# EAGLE design analog-sampler-testbed (EAGLE 9.5.0)
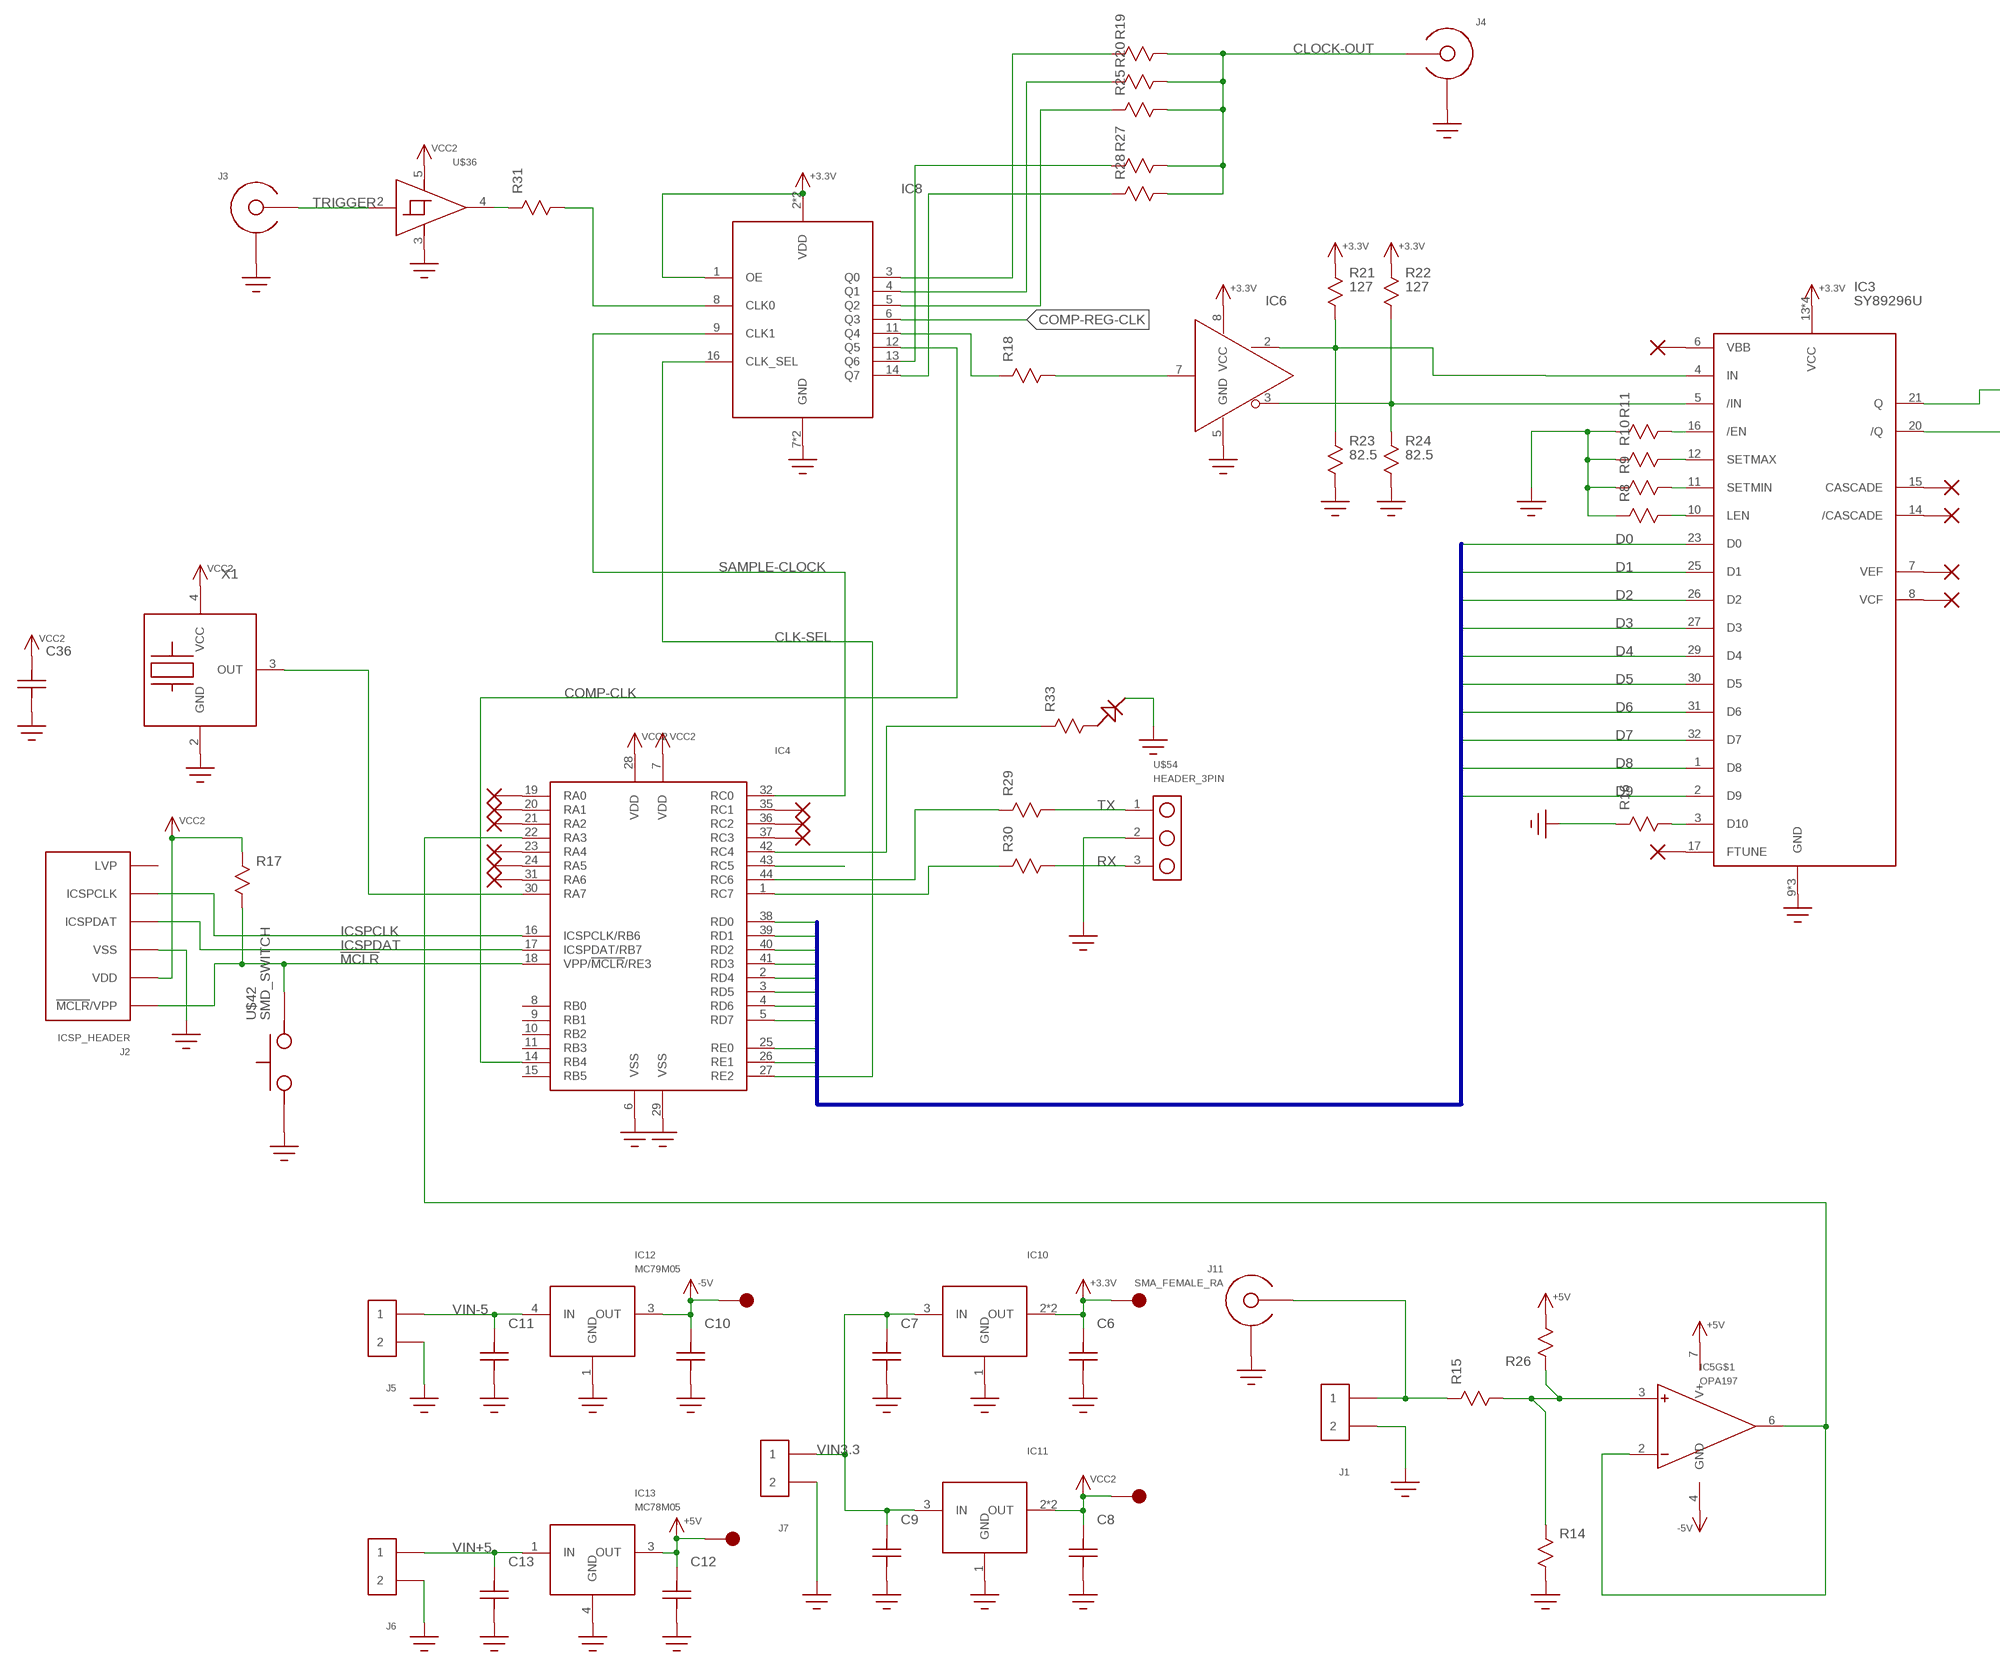
[diagram p0: schematic, sheet 1, part 1 of 2]
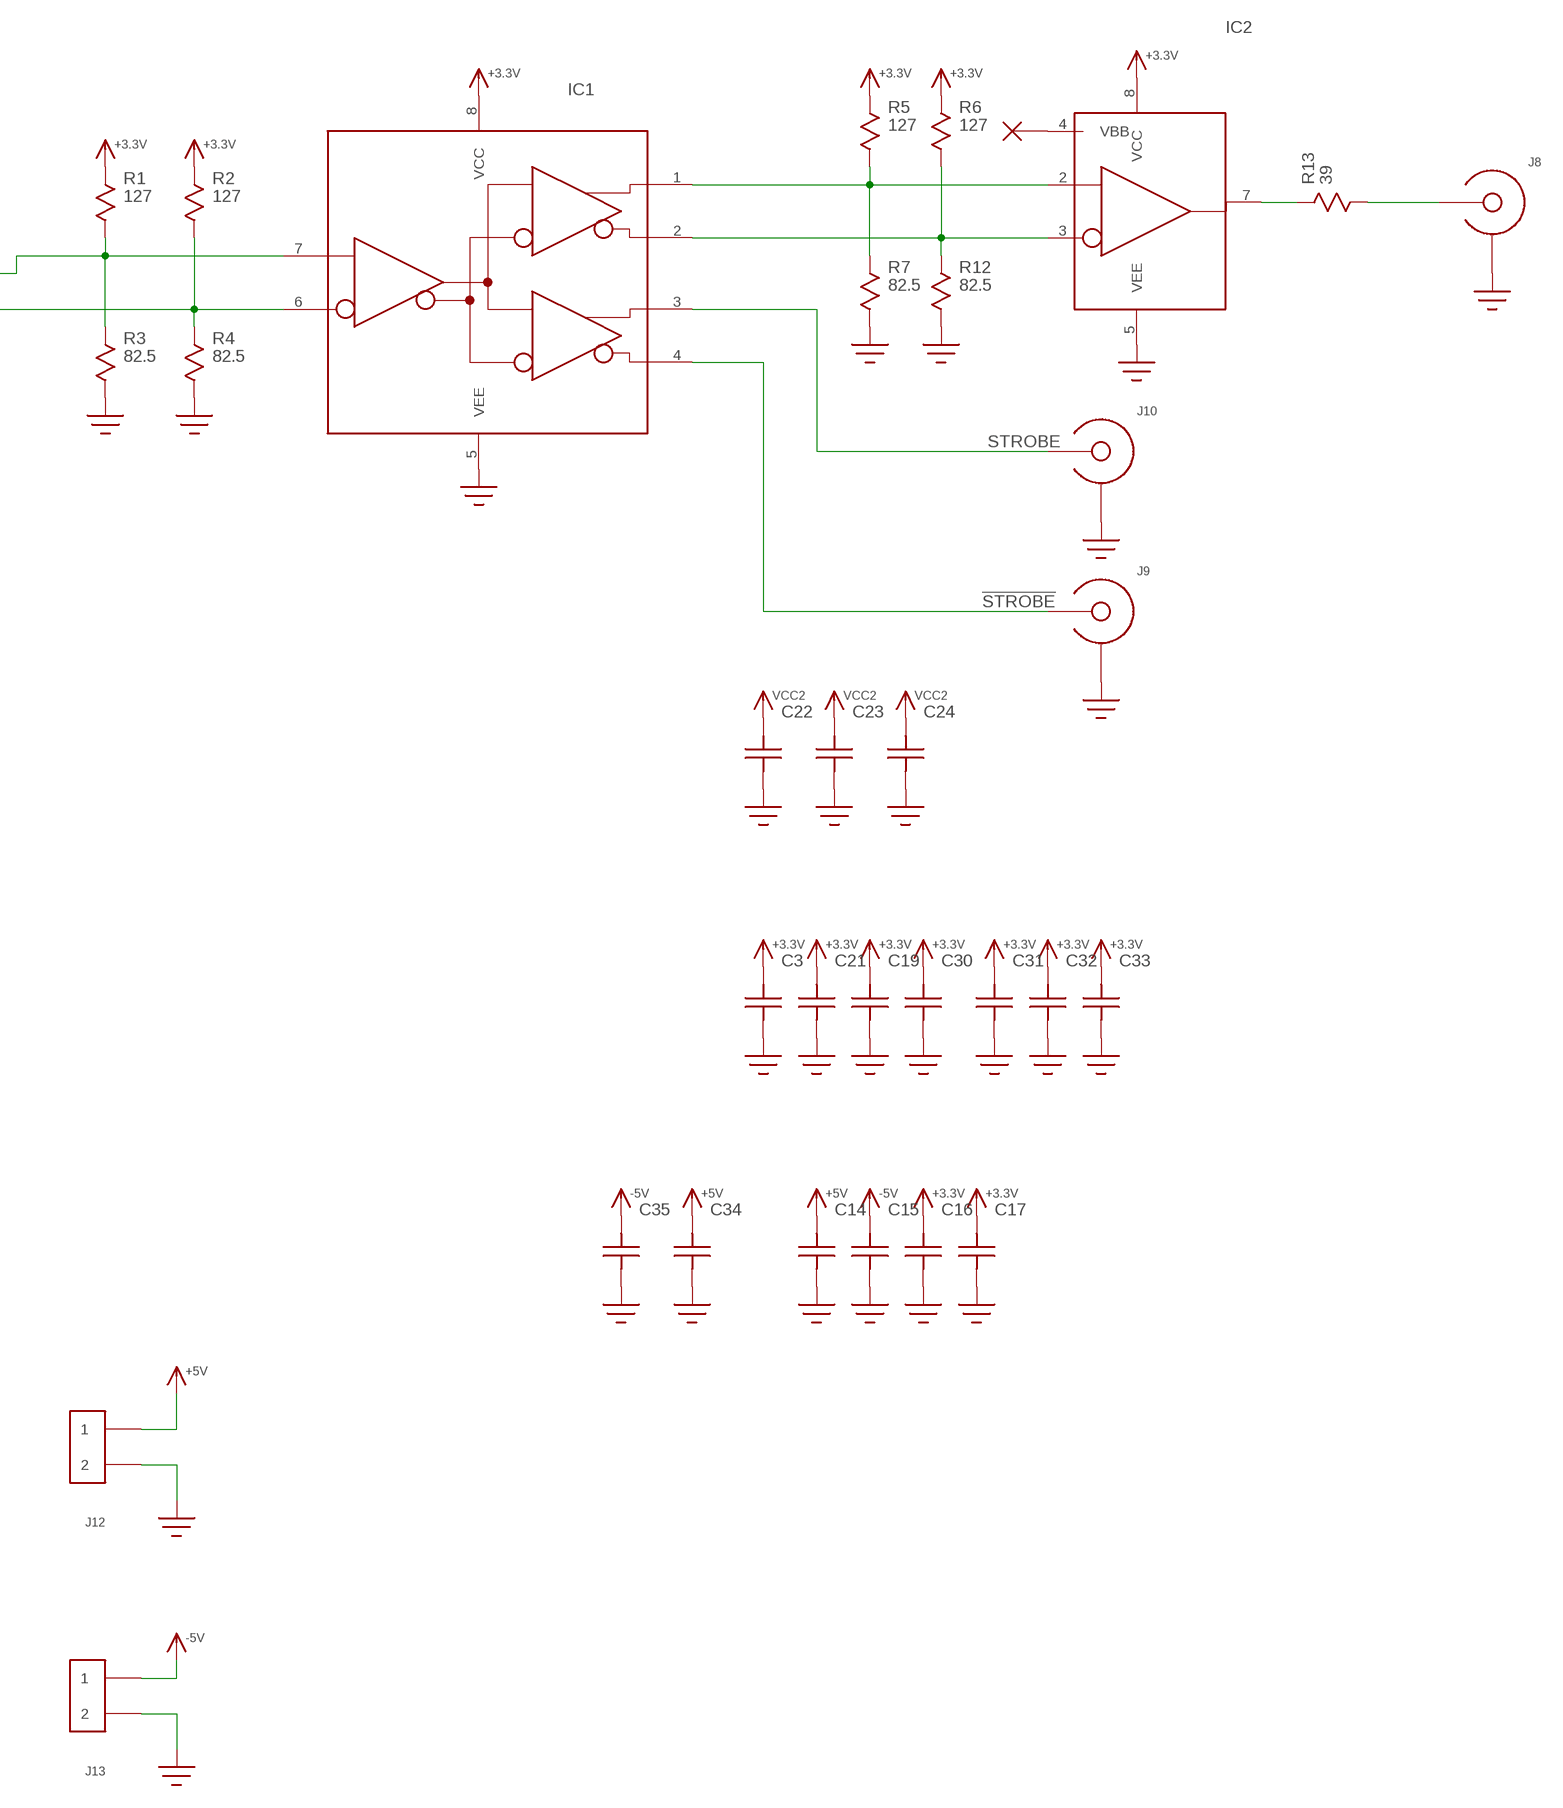
[diagram p1: schematic, sheet 1, part 2 of 2]

## Parts
C3  C0603  [C0603]
C6  C1206  [1206]
C7  C1206  [1206]
C8  C1206  [1206]
C9  C1206  [1206]
C10  C1206  [1206]
C11  C1206  [1206]
C12  C1206  [1206]
C13  C1206  [1206]
C14  C0603  [C0603]
C15  C0603  [C0603]
C16  C0603  [C0603]
C17  C0603  [C0603]
C19  C0603  [C0603]
C21  C0603  [C0603]
C22  C0603  [C0603]
C23  C0603  [C0603]
C24  C0603  [C0603]
C30  C0603  [C0603]
C31  C0603  [C0603]
C32  C0603  [C0603]
C33  C0603  [C0603]
C34  C0603  [C0603]
C35  C0603  [C0603]
C36  C0603  [C0603]
IC1  SY10EP11U  [SOIC8]
IC2  MC100EPT21  [SOIC8]
IC3  SY89296U  [TQFP32_7X7]
IC4  PIC16F15376  [TQFP44]
IC5  OPA197  OPA197SOIC8  [SOIC8]
IC6  MC100LVELT20  [SOIC8]
IC8  SI53360TSSOP16  [TSSOP16]
IC10  AZ1117E  [SOT-223]
IC11  AZ1117E  [SOT-223]
IC12  MC79M05  MC79M00  [DPAK]
IC13  MC78M05  MC78M00  [DPAK]
J1  HEADER_2PIN  [HEADER_2PIN]
J2  ICSP_HEADER  [HEADER_6PIN]
J3  SMA-EDGE-LAUNCH4L-4020-TAPER-FIXED  [SMA_EDGE_LAUNCH_4L_4020_TAPER_FIXED]
J4  SMA-EDGE-LAUNCH4L-4020-TAPER-FIXED  [SMA_EDGE_LAUNCH_4L_4020_TAPER_FIXED]
J5  HEADER_2PINSCREW-TERM  [FCI_20020316_SCREW_TERM_2P]
J6  HEADER_2PINSCREW-TERM  [FCI_20020316_SCREW_TERM_2P]
J7  HEADER_2PINSCREW-TERM  [FCI_20020316_SCREW_TERM_2P]
J8  SMA-EDGE-LAUNCH4L-4020-TAPER-FIXED  [SMA_EDGE_LAUNCH_4L_4020_TAPER_FIXED]
J9  SMA-EDGE-LAUNCH4L-4020-TAPER-FIXED  [SMA_EDGE_LAUNCH_4L_4020_TAPER_FIXED]
J10  SMA-EDGE-LAUNCH4L-4020-TAPER-FIXED  [SMA_EDGE_LAUNCH_4L_4020_TAPER_FIXED]
J11  SMA_FEMALE_RA  [SMA_RA_PCB]
J12  HEADER_2PIN  [HEADER_2PIN]
J13  HEADER_2PIN  [HEADER_2PIN]
P3  ICSP_PAD  [ICSP_PAD]
P4  ICSP_PAD  [ICSP_PAD]
P5  ICSP_PAD  [ICSP_PAD]
P6  ICSP_PAD  [ICSP_PAD]
R1  127  R0603  [R0603]
R2  127  R0603  [R0603]
R3  82.5  R0603  [R0603]
R4  82.5  R0603  [R0603]
R5  127  R0603  [R0603]
R6  127  R0603  [R0603]
R7  82.5  R0603  [R0603]
R8  R0402  [0402]
R9  R0402  [0402]
R10  R0402  [0402]
R11  R0402  [0402]
R12  82.5  R0603  [R0603]
R13  39  R0603  [R0603]
R14  R0603  [R0603]
R15  R0603  [R0603]
R16  R0603  [R0603]
R17  R0603  [R0603]
R18  R0603  [R0603]
R19  R0402  [0402]
R20  R0402  [0402]
R21  127  R0603  [R0603]
R22  127  R0603  [R0603]
R23  82.5  R0603  [R0603]
R24  82.5  R0603  [R0603]
R25  R0402  [0402]
R26  R0603  [R0603]
R27  R0402  [0402]
R28  R0402  [0402]
R29  R0603  [R0603]
R30  R0603  [R0603]
R31  R0603  [R0603]
R33  R0603  [R0603]
U$11  NO_CONNECT  (no package)
U$24  NO_CONNECT  (no package)
U$25  NO_CONNECT  (no package)
U$26  NO_CONNECT  (no package)
U$27  NO_CONNECT  (no package)
U$28  NO_CONNECT  (no package)
U$36  74LVC1G17  [SOT23-5]
U$42  SMD_SWITCH  [SMD_SWITCH]
U$54  HEADER_3PIN  [HEADER_3PIN]
U$57  NO_CONNECT  (no package)
U$86  NO_CONNECT  (no package)
U$87  NO_CONNECT  (no package)
U$88  LED_0603  [LED_0603]
U$90  NO_CONNECT  (no package)
U$91  NO_CONNECT  (no package)
U$92  NO_CONNECT  (no package)
U$93  NO_CONNECT  (no package)
U$95  NO_CONNECT  (no package)
U$96  NO_CONNECT  (no package)
U$98  NO_CONNECT  (no package)
X1  XTAL_OSC  [XTAL_3.2X5]

## Nets
!MCLR!: IC4.18(VPP/!MCLR!/RE3) J2.1(!MCLR!/VPP) R17.P$2 U$42.P$3 U$42.P$4
!STROBE!: IC1.4(!Q1!) J9.CENTER@1(CENTER) J9.P$3(CENTER)
+3.3V: C3.P$2 C6.P$2 C16.P$2 C17.P$2 C19.P$2 C21.P$2 C30.P$2 C31.P$2 C32.P$2 C33.P$2 IC1.8(VCC) IC2.8(VCC) IC3.13(VCC) IC3.18(VCC) IC3.19(VCC) IC3.22(VCC) IC6.8(VCC) IC8.1(OE) IC8.2(VDD) IC8.15(VDD) IC10.2(OUT) IC10.4(OUT) P5.P$1 R1.P$1 R2.P$1 R5.P$1 R6.P$1 R21.P$1 R22.P$1
+5V: C12.P$2 C14.P$2 C34.P$2 IC5.7(V+) IC13.3(OUT) J12.1 P4.P$1 R26.P$2
-5V: C10.P$2 C15.P$2 C35.P$2 IC5.4(GND) IC12.3(OUT) J13.1 P3.P$1
CLK-SEL: IC4.27(RE2) IC8.16(CLK_SEL)
CLOCK-OUT: J4.CENTER@1(CENTER) J4.P$3(CENTER) R19.2 R20.2 R25.2 R27.2 R28.2
COMP-CLK: IC4.14(RB4) IC8.12(Q5)
COMP-REG-CLK: IC8.6(Q3)
D0: IC3.23(D0) IC4.38(RD0)
D1: IC3.25(D1) IC4.39(RD1)
D2: IC3.26(D2) IC4.40(RD2)
D3: IC3.27(D3) IC4.41(RD3)
D4: IC3.29(D4) IC4.2(RD4)
D5: IC3.30(D5) IC4.3(RD5)
D6: IC3.31(D6) IC4.4(RD6)
D7: IC3.32(D7) IC4.5(RD7)
D8: IC3.1(D8) IC4.25(RE0)
D9: IC3.2(D9) IC4.26(RE1)
GND: C3.P$1 C6.P$1 C7.P$1 C8.P$1 C9.P$1 C10.P$1 C11.P$1 C12.P$1 C13.P$1 C14.P$1 C15.P$1 C16.P$1 C17.P$1 C19.P$1 C21.P$1 C22.P$1 C23.P$1 C24.P$1 C30.P$1 C31.P$1 C32.P$1 C33.P$1 C34.P$1 C35.P$1 C36.P$1 IC1.5(VEE) IC2.5(VEE) IC3.9(GND) IC3.24(GND) IC3.28(GND) IC4.6(VSS) IC4.29(VSS) IC6.5(GND) IC8.7(GND) IC8.10(GND) IC10.1(GND) IC11.1(GND) IC12.1(GND) IC13.4(GND) J1.2 J2.3(VSS) J3.BOTTOM_GND(SHIELD) J3.GND@1(SHIELD) J3.GND@2(SHIELD) J3.GND@3(SHIELD) J3.GND@4(SHIELD) J3.GND@5(SHIELD) J3.GND@6(SHIELD) J3.GND@7(SHIELD) J3.GND@8(SHIELD) J3.GND@14(SHIELD) J3.GND@15(SHIELD) J3.GND@16(SHIELD) J3.GND@17(SHIELD) J3.GND_PAD1(SHIELD) J3.GND_PAD2(SHIELD) J3.P$1(SHIELD) J3.P$2(SHIELD) J4.BOTTOM_GND(SHIELD) J4.GND@1(SHIELD) J4.GND@2(SHIELD) J4.GND@3(SHIELD) J4.GND@4(SHIELD) J4.GND@5(SHIELD) J4.GND@6(SHIELD) J4.GND@7(SHIELD) J4.GND@8(SHIELD) J4.GND@14(SHIELD) J4.GND@15(SHIELD) J4.GND@16(SHIELD) J4.GND@17(SHIELD) J4.GND_PAD1(SHIELD) J4.GND_PAD2(SHIELD) J4.P$1(SHIELD) J4.P$2(SHIELD) J5.P$2 J6.P$2 J7.P$2 J8.BOTTOM_GND(SHIELD) J8.GND@1(SHIELD) J8.GND@2(SHIELD) J8.GND@3(SHIELD) J8.GND@4(SHIELD) J8.GND@5(SHIELD) J8.GND@6(SHIELD) J8.GND@7(SHIELD) J8.GND@8(SHIELD) J8.GND@14(SHIELD) J8.GND@15(SHIELD) J8.GND@16(SHIELD) J8.GND@17(SHIELD) J8.GND_PAD1(SHIELD) J8.GND_PAD2(SHIELD) J8.P$1(SHIELD) J8.P$2(SHIELD) J9.BOTTOM_GND(SHIELD) J9.GND@1(SHIELD) J9.GND@2(SHIELD) J9.GND@3(SHIELD) J9.GND@4(SHIELD) J9.GND@5(SHIELD) J9.GND@6(SHIELD) J9.GND@7(SHIELD) J9.GND@8(SHIELD) J9.GND@14(SHIELD) J9.GND@15(SHIELD) J9.GND@16(SHIELD) J9.GND@17(SHIELD) J9.GND_PAD1(SHIELD) J9.GND_PAD2(SHIELD) J9.P$1(SHIELD) J9.P$2(SHIELD) J10.BOTTOM_GND(SHIELD) J10.GND@1(SHIELD) J10.GND@2(SHIELD) J10.GND@3(SHIELD) J10.GND@4(SHIELD) J10.GND@5(SHIELD) J10.GND@6(SHIELD) J10.GND@7(SHIELD) J10.GND@8(SHIELD) J10.GND@14(SHIELD) J10.GND@15(SHIELD) J10.GND@16(SHIELD) J10.GND@17(SHIELD) J10.GND_PAD1(SHIELD) J10.GND_PAD2(SHIELD) J10.P$1(SHIELD) J10.P$2(SHIELD) J11.SHIELD@1(SHIELD) J11.SHIELD@2(SHIELD) J11.SHIELD@3(SHIELD) J11.SHIELD@4(SHIELD) J12.2 J13.2 R3.P$2 R4.P$2 R7.P$2 R8.1 R9.1 R10.1 R11.1 R12.P$2 R14.P$2 R16.P$1 R23.P$2 R24.P$2 U$36.3(GND) U$42.P$1 U$42.P$2 U$54.2 U$88.C X1.2(GND)
ICSPCLK: IC4.16(ICSPCLK/RB6) J2.5(ICSPCLK)
ICSPDAT: IC4.17(ICSPDAT/RB7) J2.4(ICSPDAT)
LE_N: IC1.7(D) IC3.21(Q) R1.P$2 R3.P$1
LE_P1: IC1.6(!D!) IC3.20(/Q) R2.P$2 R4.P$1
N$1: R31.P$1 U$36.4(OUT)
N$2: IC1.1(Q0) IC2.2(D) R5.P$2 R7.P$1
N$3: IC1.2(!Q0!) IC2.3(!D!) R6.P$2 R12.P$1
N$4: IC2.4(VBB) U$11.P$1
N$5: IC2.7(Q) R13.P$1
N$6: IC3.16(/EN) R11.2
N$7: IC3.12(SETMAX) R10.2
N$8: IC3.11(SETMIN) R9.2
N$9: IC3.10(LEN) R8.2
N$10: IC3.15(CASCADE) U$24.P$1
N$11: IC3.14(/CASCADE) U$25.P$1
N$12: IC3.7(VEF) U$26.P$1
N$13: IC3.8(VCF) U$27.P$1
N$14: IC3.6(VBB) U$28.P$1
N$15: J8.CENTER@1(CENTER) J8.P$3(CENTER) R13.P$2
N$16: IC3.4(IN) IC6.2(Q) R21.P$2 R23.P$1
N$17: IC4.22(RA3) IC5.2(-) IC5.6(OUT)
N$18: IC8.11(Q4) R18.P$1
N$19: IC5.3(+) R14.P$1 R15.P$2 R26.P$1
N$20: IC4.43(RC5)
N$21: J1.1 J11.CENTER R15.P$1
N$22: IC3.5(/IN) IC6.3(!Q!) R22.P$2 R24.P$1
N$23: IC8.8(CLK0) R31.P$2
N$24: IC4.30(RA7) X1.3(OUT)
N$25: IC4.42(RC4) R33.P$1
N$26: R33.P$2 U$88.A
N$35: IC3.3(D10) R16.P$2
N$36: IC6.7(D) R18.P$2
N$38: IC8.14(Q7) R28.1
N$39: IC8.13(Q6) R27.1
N$41: IC8.5(Q2) R25.1
N$42: IC8.4(Q1) R20.1
N$43: IC8.3(Q0) R19.1
N$44: IC4.44(RC6) R29.P$1
N$45: IC4.1(RC7) R30.P$1
N$47: IC4.35(RC1) U$57.P$1
N$48: IC4.36(RC2) U$86.P$1
N$49: IC4.37(RC3) U$87.P$1
N$52: IC3.17(FTUNE) U$90.P$1
N$53: IC4.19(RA0) U$91.P$1
N$54: IC4.20(RA1) U$92.P$1
N$55: IC4.21(RA2) U$93.P$1
N$57: IC4.23(RA4) U$95.P$1
N$58: IC4.24(RA5) U$96.P$1
N$60: IC4.31(RA6) U$98.P$1
RX: R30.P$2 U$54.3
SAMPLE-CLOCK: IC4.32(RC0) IC8.9(CLK1)
STROBE: IC1.3(Q1) J10.CENTER@1(CENTER) J10.P$3(CENTER)
TRIGGER: J3.CENTER@1(CENTER) J3.P$3(CENTER) U$36.2(IN)
TX: R29.P$2 U$54.1
VCC2: C8.P$2 C22.P$2 C23.P$2 C24.P$2 C36.P$2 IC4.7(VDD) IC4.28(VDD) IC11.2(OUT) IC11.4(OUT) J2.2(VDD) P6.P$1 R17.P$1 U$36.5(VCC) X1.4(VCC)
VIN3.3: C7.P$2 C9.P$2 IC10.3(IN) IC11.3(IN) J7.P$1
VIN+5: C13.P$2 IC13.1(IN) J6.P$1
VIN-5: C11.P$2 IC12.4(IN) J5.P$1
Unconnected: IC4.8(RB0) IC4.9(RB1) IC4.10(RB2) IC4.11(RB3) IC4.15(RB5) J2.6(LVP)

## Buses
D0,D1,D2,D3,D4,D5,D6,D7,D8,D9

## Library data of the parts
C3 C6-C17 C19 C21-C24 C30-C36 = yapo:C
IC1 = yapo:SY10EP11U
IC2 = yapo:MC100EPT21
IC3 = yapo:SY89296U
IC4 = yapo:PIC16F15376
IC5 = yapo:OPA197
IC6 = yapo:MC100LVELT20
IC8 = yapo:SI53360
IC10 IC11 = yapo:AZ1117E
IC12 = yapo:MC79M00
IC13 = yapo:MC78M00
J1 J5-J7 J12 J13 = yapo:HEADER_2PIN
J2 = yapo:ICSP_HEADER
J3 J4 J8-J10 = sma_footprint_2l:SMA-EDGE-LAUNCH
J11 = yapo:SMA_FEMALE_RA
P3-P6 = yapo:ICSP_PAD
R1-R31 R33 = yapo:R
U$11 U$24-U$28 U$57 U$86 U$87 U$90-U$93 U$95 U$96 U$98 = yapo:NO_CONNECT
U$36 = yapo:74LVC1G17
U$42 = yapo:SMD_SWITCH
U$54 = yapo:HEADER_3PIN
U$88 = yapo:LED_0603
X1 = yapo:XTAL_OSC

## Net classes
1 diff-pair: width 0.33 mm, clearance 0.203 mm
2 50-ohm: width 0.349 mm

## Board
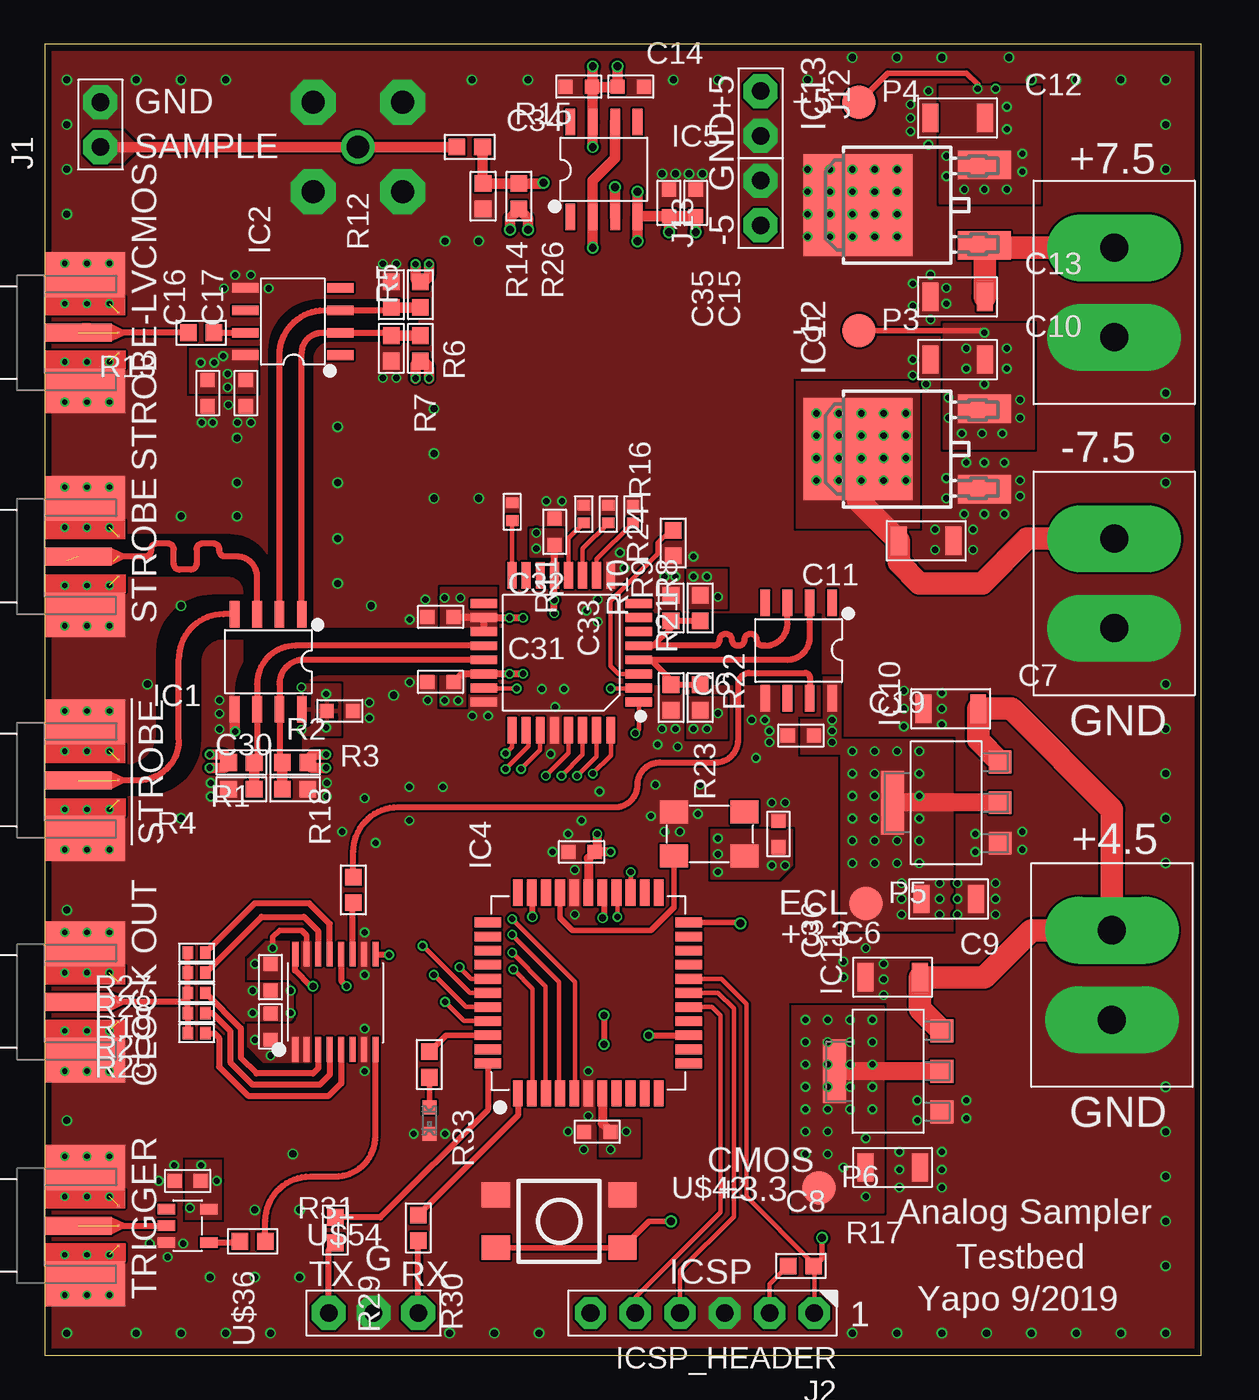
[diagram p2: board, top side]
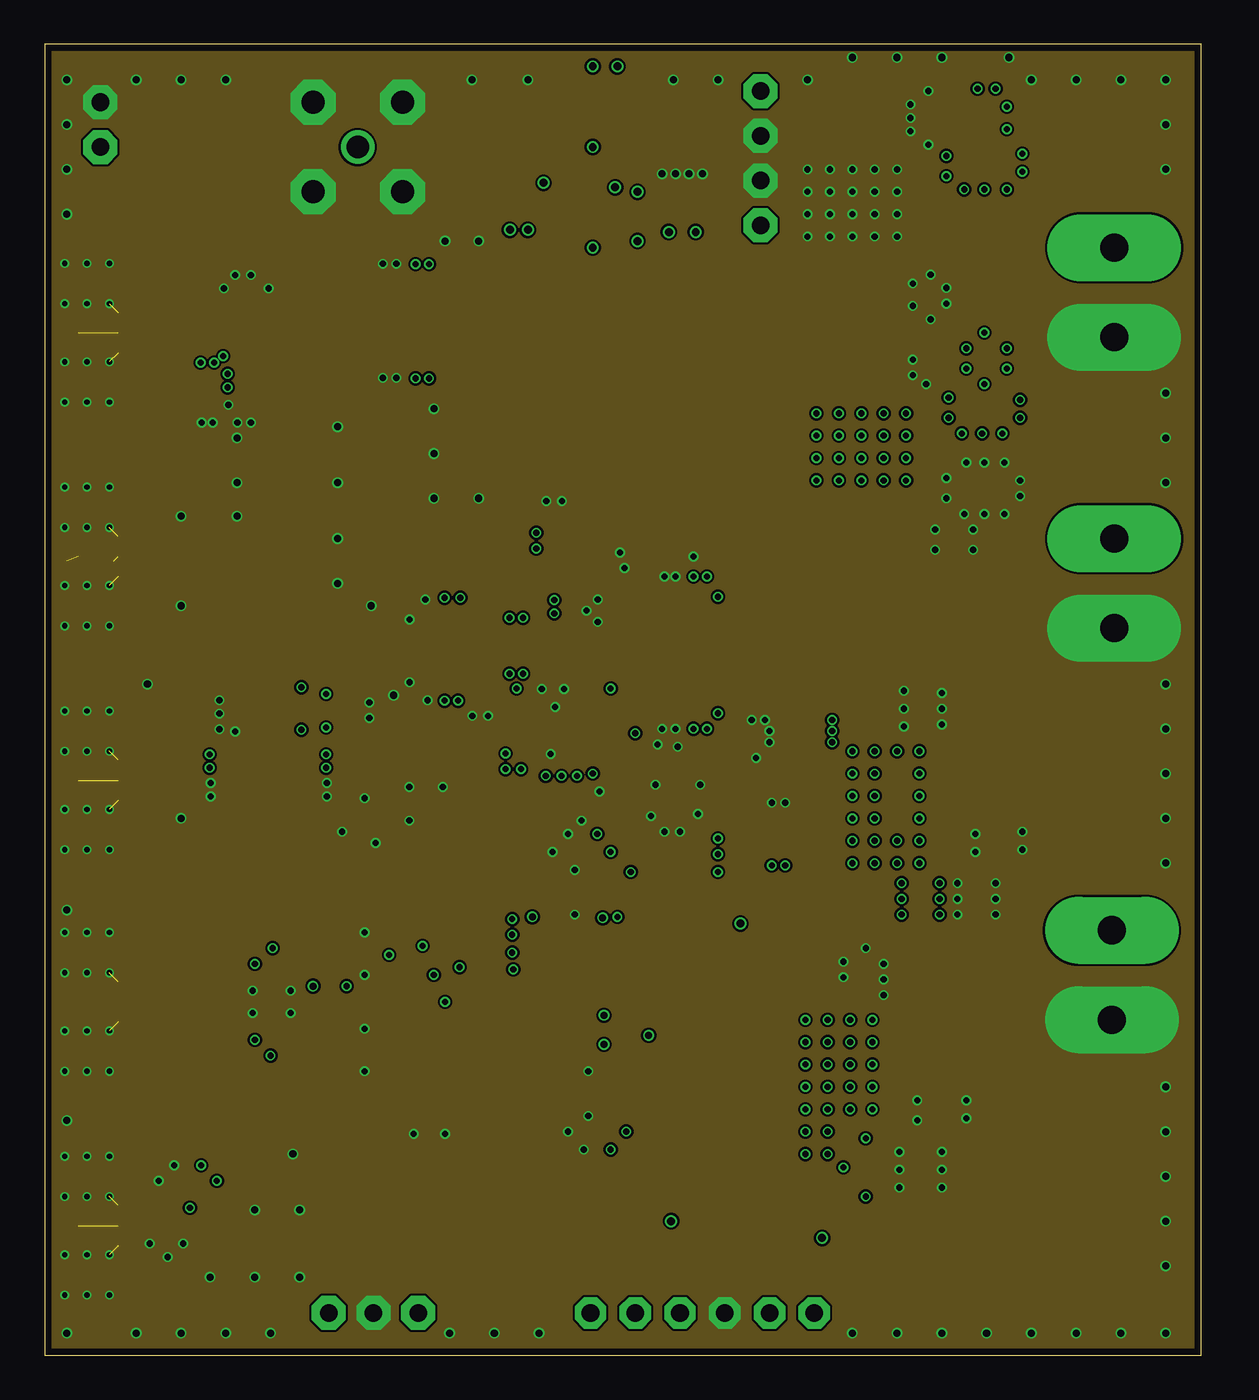
[diagram p3: board, inner layer Route2]
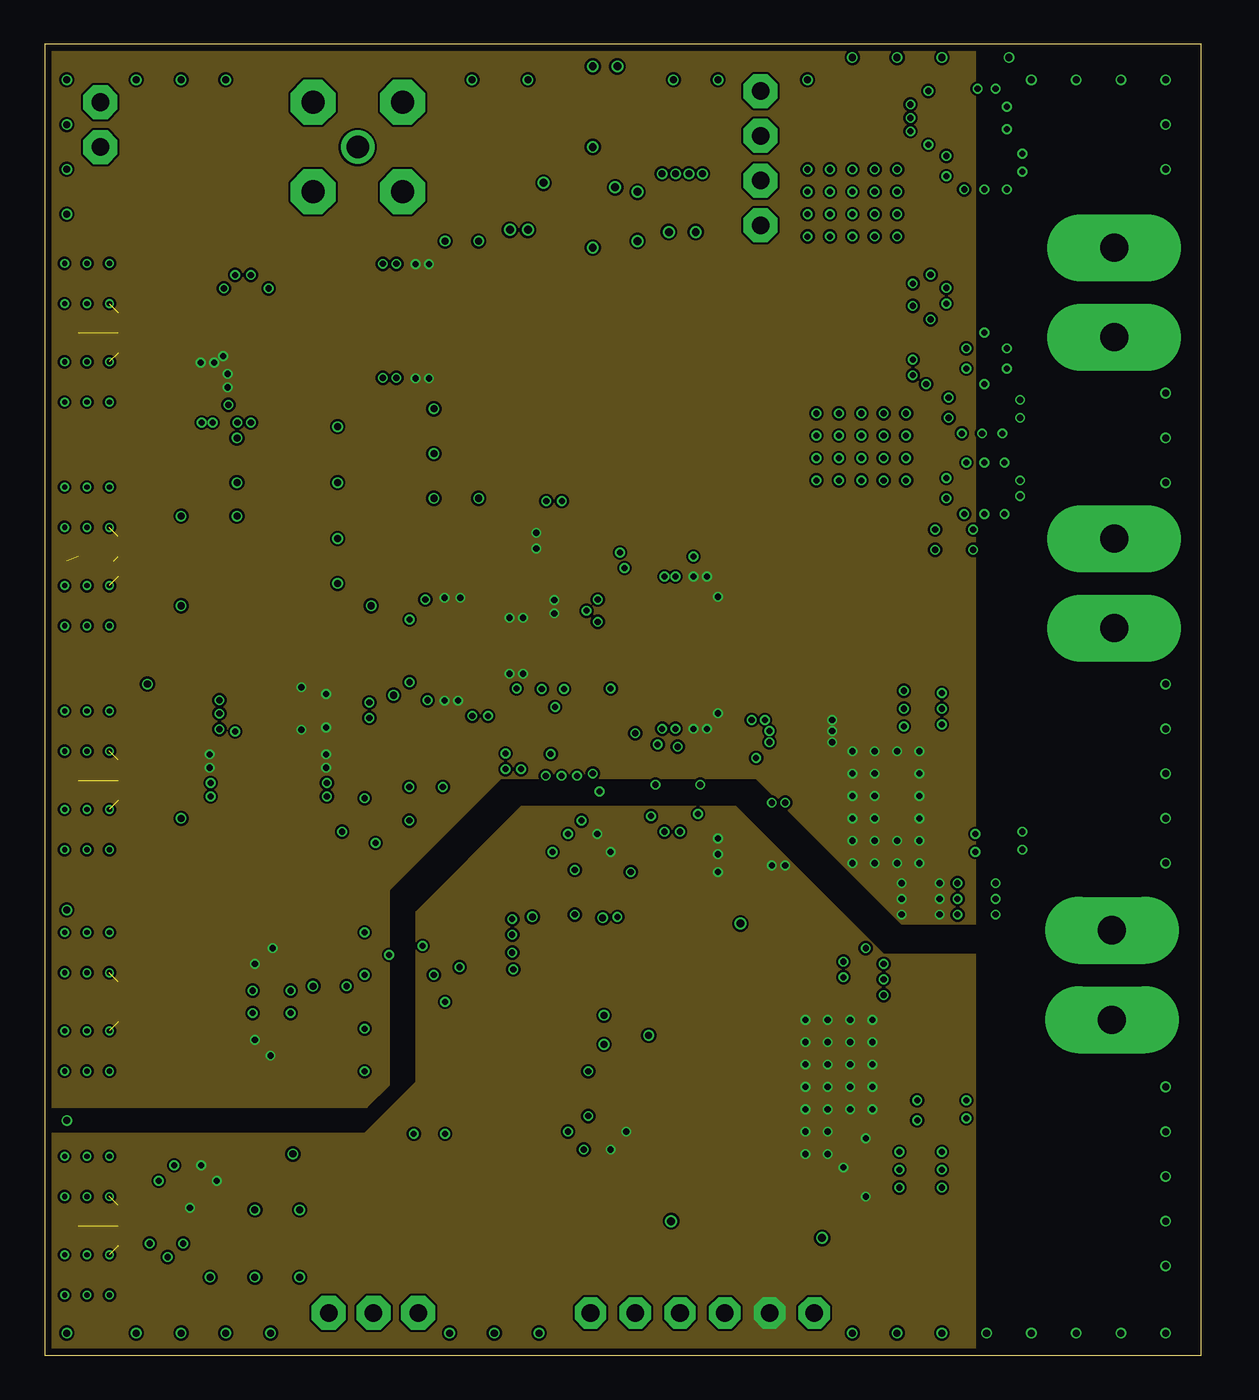
[diagram p4: board, inner layer Route15]
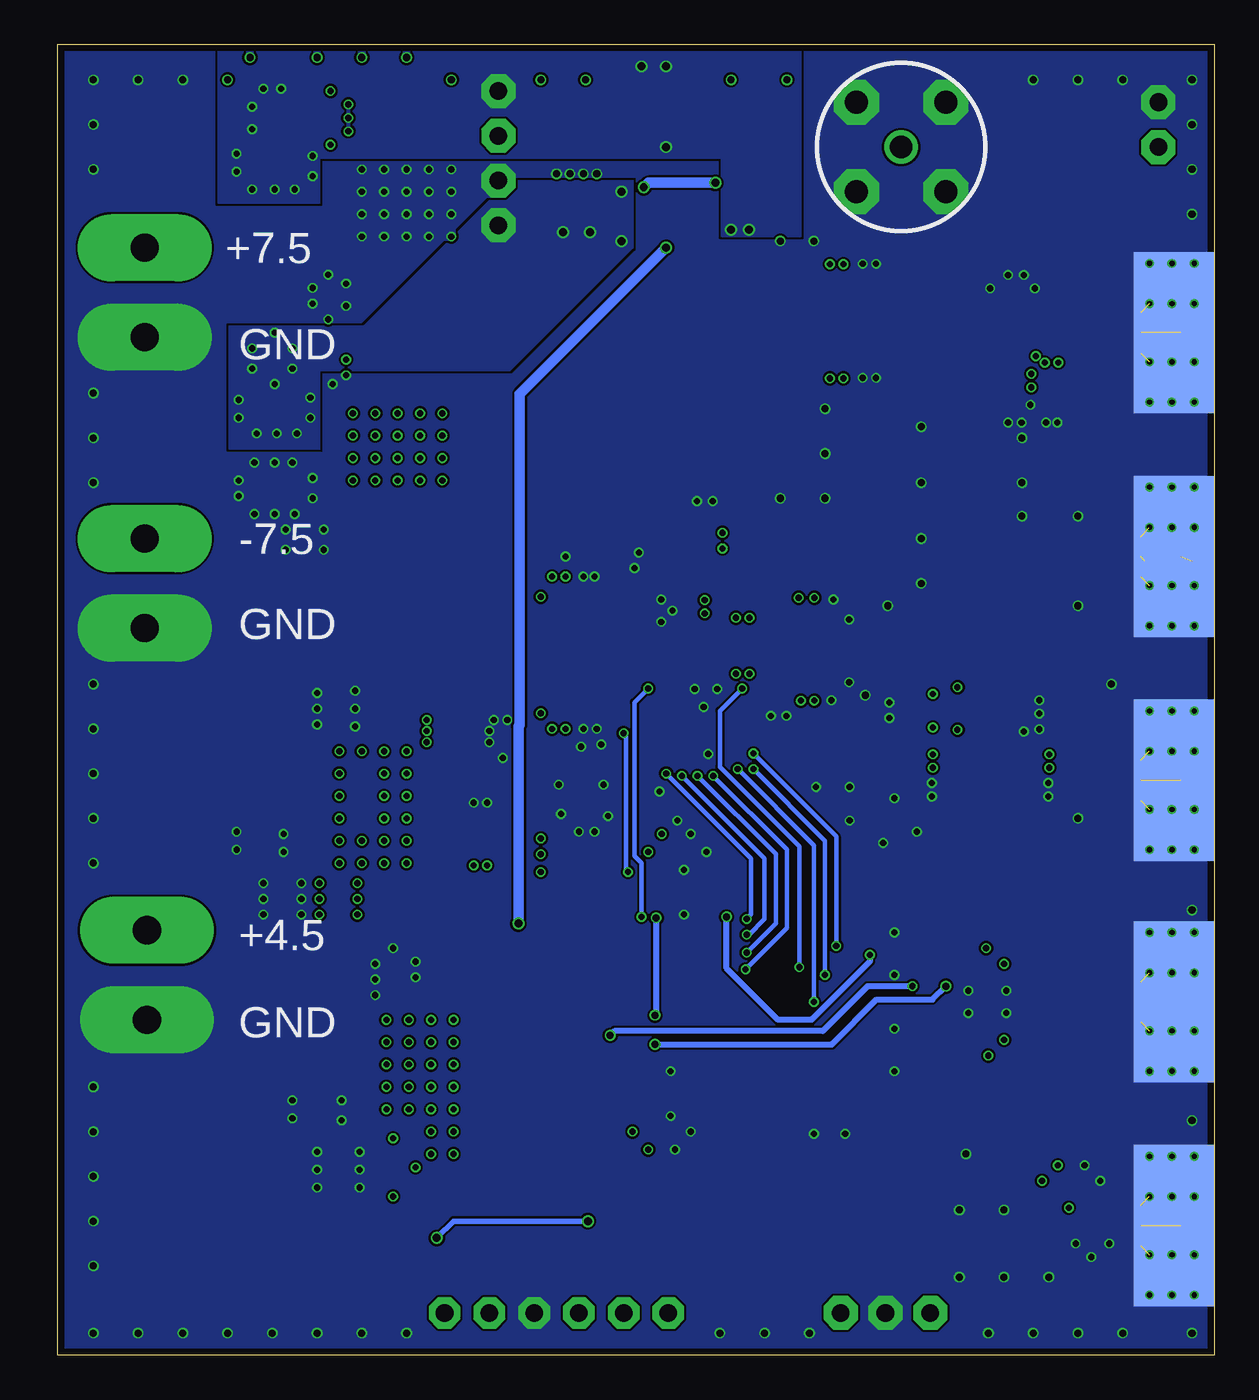
[diagram p5: board, bottom side, seen from below]

Size 65.66 x 74.42 mm. Coordinates in mm from the lower left corner, seen from the top.
Outline: 0,0 65.66,0 65.66,74.42 0,74.42 0,0
Copper layers (1*2*15*16): Top 0.035559375mm / dielectric 0.17018125mm / Route2 0.01778125mm / dielectric 47mil / Route15 0.01778125mm / dielectric 0.17018125mm / Bottom 0.035559375mm
Design rules "oshpark-4layer *": minimum track width 5mil, minimum drill 10mil, track to track 5mil, track to pad 5mil, pad to pad 5mil, via to via 5mil, smd to smd 5mil, copper to edge 15mil, drill to drill 6mil, minimum pad ring 4mil, minimum via ring 4mil, stop-mask expansion 2.5mil, vias tented up to drill 20mil, thermal gap 10mil

### Footprints (pad centres in the part's own frame; a part is rotated, then mirrored left to right if it is on the bottom)
C0603 = smd 0.8 x 0.8: P$1 -0.75,0; P$2 0.75,0
1206 = smd 0.9 x 1.6: P$1 -1.55,0; P$2 1.55,0
SOIC8 = smd 0.55 x 1.5: 1 -1.905,-2.7; 2 -0.635,-2.7; 3 0.635,-2.7; 4 1.905,-2.7; 5 1.905,2.7; 6 0.635,2.7; 7 -0.635,2.7; 8 -1.905,2.7
TQFP32_7X7 = smd 1.5 x 0.5: 1 -4.4,2.8; 2 -4.4,2; 3 -4.4,1.2; 4 -4.4,0.4; 5 -4.4,-0.4; 6 -4.4,-1.2; 7 -4.4,-2; 8 -4.4,-2.8; 17 4.4,-2.8; 18 4.4,-2; 19 4.4,-1.2; 20 4.4,-0.4; 21 4.4,0.4; 22 4.4,1.2; 23 4.4,2; 24 4.4,2.8 | smd 0.5 x 1.5: 9 -2.8,-4.4; 10 -2,-4.4; 11 -1.2,-4.4; 12 -0.4,-4.4; 13 0.4,-4.4; 14 1.2,-4.4; 15 2,-4.4; 16 2.8,-4.4; 25 2.8,4.4; 26 2,4.4; 27 1.2,4.4; 28 0.4,4.4; 29 -0.4,4.4; 30 -1.2,4.4; 31 -2,4.4; 32 -2.8,4.4
TQFP44 = smd 1.5 x 0.55: 1 -5.7,4; 2 -5.7,3.2; 3 -5.7,2.4; 4 -5.7,1.6; 5 -5.7,0.8; 6 -5.7,0; 7 -5.7,-0.8; 8 -5.7,-1.6; 9 -5.7,-2.4; 10 -5.7,-3.2; 11 -5.7,-4; 23 5.7,-4; 24 5.7,-3.2; 25 5.7,-2.4; 26 5.7,-1.6; 27 5.7,-0.8; 28 5.7,0; 29 5.7,0.8; 30 5.7,1.6; 31 5.7,2.4; 32 5.7,3.2; 33 5.7,4 | smd 0.55 x 1.5: 12 -4,-5.7; 13 -3.2,-5.7; 14 -2.4,-5.7; 15 -1.6,-5.7; 16 -0.8,-5.7; 17 0,-5.7; 18 0.8,-5.7; 19 1.6,-5.7; 20 2.4,-5.7; 21 3.2,-5.7; 22 4,-5.7; 34 4,5.7; 35 3.2,5.7; 36 2.4,5.7; 37 1.6,5.7; 38 0.8,5.7; 39 0,5.7; 40 -0.8,5.7; 41 -1.6,5.7; 42 -2.4,5.7; 43 -3.2,5.7; 44 -4,5.7
TSSOP16 = smd 0.35 x 1.4: 1 -2.275,-2.7; 2 -1.625,-2.7; 3 -0.975,-2.7; 4 -0.325,-2.7; 5 0.325,-2.7; 6 0.975,-2.7; 7 1.625,-2.7; 8 2.275,-2.7; 9 2.275,2.7; 10 1.625,2.7; 11 0.975,2.7; 12 0.325,2.7; 13 -0.325,2.7; 14 -0.975,2.7; 15 -1.625,2.7; 16 -2.275,2.7
SOT-223 = smd 1.3 x 1.3: 1 -2.3,-3.05; 2 0,-3.05; 3 2.3,-3.05 | smd 3.6 x 1.3: 4 0,3.05
DPAK = smd 1.6 x 3: 1 -2.285,0; 3 2.285,0 | smd 5.8 x 6.2: 4 0,7.18
HEADER_2PIN = drill 1 pad 1.93 octagon: 1 -1.27,0; 2 1.27,0
HEADER_6PIN = drill 1 pad 1.778 octagon: 1 -6.35,0; 2 -3.81,0; 3 -1.27,0; 4 1.27,0; 5 3.81,0; 6 6.35,0
SMA_EDGE_LAUNCH_4L_4020_TAPER_FIXED = smd 4.572 x 9.144 bottom: BOTTOM_GND 2.286,0 | smd 3.81 x 1.016: CENTER@1 1.905,0 | drill 0.3: GND@1 1.143,3.937; GND@2 3.683,3.937; GND@3 1.143,1.651; GND@4 3.683,1.651; GND@5 1.143,-1.651; GND@6 3.683,-1.651; GND@7 1.143,-3.937; GND@8 3.683,-3.937; GND@14 2.413,3.937; GND@15 2.413,-3.937; GND@16 2.413,-1.651; GND@17 2.413,1.651 | smd 4.572 x 2.54: GND_PAD1 2.286,3.302; GND_PAD2 2.286,-3.302 | smd 0.127 x 0.127: P$1 4.191,1.143; P$2 4.191,-1.143; P$3 4.191,0
FCI_20020316_SCREW_TERM_2P = drill 1.6 pad 3.81 long: P$1 -2.54,0; P$2 2.54,0
SMA_RA_PCB = drill 1.27 pad 1.778: CENTER 0,0 | drill 1.321 pad 2.54 octagon: SHIELD@1 -2.54,-2.54; SHIELD@2 -2.54,2.54; SHIELD@3 2.54,2.54; SHIELD@4 2.54,-2.54
ICSP_PAD = smd 1.905 x 1.905: P$1 0,0
R0603 = smd 0.95 x 0.95: P$1 -0.725,0; P$2 0.725,0
0402 = smd 0.6 x 0.7: 1 -0.5,0; 2 0.5,0
SOT23-5 = smd 0.6 x 1: 1 -0.95,-1.2; 2 0,-1.2; 3 0.95,-1.2; 4 0.95,1.2; 5 -0.95,1.2
SMD_SWITCH = smd 1.6 x 1.4: P$1 -3.6,1.5; P$2 3.6,1.5; P$3 3.6,-1.5; P$4 -3.6,-1.5
HEADER_3PIN = drill 1 pad 1.93 octagon: 1 -2.54,0; 2 0,0; 3 2.54,0
LED_0603 = smd 0.8 x 0.8: A -0.75,0; C 0.75,0
XTAL_3.2X5 = smd 1.6 x 1.3: 1 -2,-1.25; 2 2,-1.25; 3 2,1.25; 4 -2,1.25

### Placement (x,y rotation side)
C3  12.83,21.46 90 top
C6  51.31,25.91 180 top
C7  51.44,36.7 0 top
C8  48.13,10.67 180 top
C9  48.13,21.46 0 top
C10  51.82,56.52 0 top
C11  50.04,46.23 180 top
C12  51.82,70.23 0 top
C13  51.82,60.07 0 top
C14  30.33,72.01 0 top
C15  36.96,65.41 270 top
C16  9.27,54.61 90 top
C17  11.43,54.61 90 top
C19  42.93,35.18 0 top
C21  12.83,18.67 270 top
C22  30.48,28.57 0 top
C23  31.37,12.7 0 top
C24  8.13,9.91 0 top
C30  16.76,36.58 180 top
C31  22.48,38.23 0 top
C32  22.48,41.91 0 top
C33  28.96,46.74 270 top
C34  33.27,72.01 180 top
C35  35.43,65.41 270 top
C36  41.66,29.59 270 top
IC1  12.7,39.37 180 top
IC2  14.1,58.67 90 top
IC3  29.34,39.88 180 top
IC4  30.86,20.57 90 top
IC5  31.75,67.31 0 top
IC6  42.8,40.01 180 top
IC8  16.51,20.07 0 top
IC10  51.18,31.37 90 top
IC11  47.88,16.13 90 top
IC12  53.34,51.44 90 top
IC13  53.34,65.28 90 top
J1  3.17,69.85 90 top
J2  37.34,2.41 180 top
J3  0,7.37 0 top
J4  0,20.07 0 top
J5  60.71,43.81 270 top
J6  60.71,60.33 270 top
J7  60.58,21.59 270 top
J8  0,58.04 0 top
J9  0,32.64 0 top
J10  0,45.34 0 top
J11  17.78,68.58 0 top
J12  40.64,70.48 270 top
J13  40.64,65.41 90 top
P3  46.23,58.17 0 top
P4  46.23,71.12 0 top
P5  46.61,25.65 0 top
P6  43.94,9.53 0 top
R1  14.22,33.66 180 top
R2  11.18,33.66 0 top
R3  14.22,32.13 0 top
R4  11.18,32.13 180 top
R5  21.34,57.15 90 top
R6  21.34,60.2 270 top
R7  19.68,57.15 270 top
R8  33.4,47.75 270 top
R9  32,47.75 270 top
R10  30.61,47.75 270 top
R11  26.54,47.88 270 top
R12  19.68,60.2 90 top
R13  8.89,58.04 180 top
R14  24.89,65.79 270 top
R15  24.13,68.58 0 top
R16  35.69,46.1 90 top
R17  42.93,5.08 0 top
R18  17.53,26.42 90 top
R19  8.64,20.57 180 top
R20  8.64,19.43 180 top
R21  37.21,37.34 90 top
R22  37.21,42.42 270 top
R23  35.56,37.34 270 top
R24  35.56,42.42 90 top
R25  8.64,18.29 180 top
R26  26.92,65.79 270 top
R27  8.64,22.86 180 top
R28  8.64,21.72 180 top
R29  16.51,7.11 270 top
R30  21.21,7.24 270 top
R31  11.81,6.48 0 top
R33  21.84,16.51 270 top
U$36  8.13,7.37 270 top
U$42  29.21,7.62 0 top
U$54  18.67,2.41 0 top
U$88  21.84,13.34 270 top
X1  37.72,29.59 180 top

### Tracks (layer width: path | path; a pad name or v marks a point on that pad's centre or on a via)
!MCLR!  (via drill 0.45)
  Top 0.254: IC4.18 36.58,21.36 38.43,21.36 39.84,19.95 39.84,9.02 43.65,5.21 R17.P$2 43.69,5.04 J2.1
  Top 0.305: v35.56,7.62 34.31,7.62 U$42.P$3 U$42.P$4 | v44.13,6.67 44.13,5.49 43.69,5.04
  Bottom 0.305: v35.56,7.62 43.18,7.62 v44.13,6.67
!STROBE!  (1 unrouted)
  Top 0.34: IC1.4 10.16,42.07 arc90 7.62,39.53 7.62,34.92 arc-90 5.33,32.64 J9.P$3
+3.3V  (via drill 0.35)
  Top 0.305: IC8.15 14.88,23.85 14.61,24.13 13.34,24.13 12.95,23.75 v12.95,23.11
  Top 0.406: IC3.18 23.23,41.88 C32.P$2 | C31.P$2 23.68,38.68 IC3.22 arc-90 IC3.22 v26.39,38.68 v27.15,38.68 | C33.P$2 arc90 28.94,45.97 IC3.13 arc90 IC3.13 v28.93,42.88 v28.93,42.11 | IC3.19 IC3.18 | IC3.18 arc90 24.96,41.86 v26.39,41.86 v27.15,41.86
  Top 0.61: v9.37,34.11 9.99,34.11 arc-90 R2.P$1 arc-90 10.15,33.35 v9.37,33.35 | v15.98,34.11 15.41,34.11 arc90 R1.P$1 arc90 15.25,33.35 v15.98,33.35 | v21.06,61.92 21.06,61.2 arc90 R6.P$1 arc90 21.82,61.41 v21.82,61.92 | v21.06,55.45 21.06,56.15 arc-90 R5.P$1 arc-90 21.82,55.94 v21.82,55.45
  Top 1.016: IC10.2 IC10.4
  other vias: 11.94,22.23 11.94,17.91 12.83,17.02 38.23,43.05 37.59,44.2 36.83,44.2 36.83,35.56 37.59,35.56 38.23,36.45 48.64,26.8 48.64,25.91 48.64,25.02 50.8,26.8 50.8,25.91 50.8,25.02 48.39,34.29 49.66,34.29 49.66,33.02 49.66,31.75 49.66,30.48 49.66,29.21 48.39,29.21 47.12,29.21 45.85,27.94 45.85,30.48 45.85,31.75 45.85,33.02 45.85,34.29 47.12,34.29 47.12,33.02 47.12,31.75 47.12,30.48 45.85,29.21 47.12,27.94 48.39,27.94 49.66,27.94 22.71,43 23.6,43 22.71,37.16 23.47,37.16 27.91,46.69 27.91,45.8 44.7,36.07 44.7,35.43 44.7,34.8 14.58,37.92 14.58,35.51 15.98,37.54 15.98,35.64 10.13,56.72 10.39,55.7 10.39,54.94 8.86,56.34 9.63,56.34
  pour Top (no thermals): 15.11,16.64 12.45,16.64 11.56,17.53 11.56,18.8 14.1,18.8 14.35,19.05 14.35,20.95 13.97,21.34 11.56,21.34 11.56,22.48 12.57,23.5 15.11,23.5
  pour Top (no thermals): 36.45,42.42 38.73,42.42 38.73,44.58 36.45,44.58
  pour Top (no thermals): 36.45,37.34 36.45,35.05 38.73,35.05 38.73,37.34
  pour Route15 (no thermals): 52.83,24.51 52.83,74.3 52.96,74.42 0,74.42 0,14.1 18.29,14.1 19.56,15.37 19.56,26.42 25.91,32.77 40.39,32.77 48.64,24.51
  pour Top (no thermals): 51.56,24.13 51.56,34.92 45.21,34.92 45.21,24.13
  pour Top (no thermals): 22.48,41.15 25.65,41.15 25.65,43.56 22.48,43.56
  pour Top (no thermals): 22.48,38.86 23.88,38.86 23.88,36.83 22.48,36.83
  pour Top (no thermals): 27.56,45.34 29.46,45.34 29.46,46.86 27.56,46.86
  pour Top (no thermals): 42.93,36.07 42.93,34.16 45.21,34.16 45.21,38.48 44.2,38.48 44.2,36.07
  pour Top: 14.35,38.1 16.76,38.1 16.76,35.18 14.35,35.18
  pour Top (no thermals): 8.26,57.15 12.06,57.15 12.06,54.61 8.26,54.61
+5V  (via drill 0.35, 0.45)
  Top 0.305: P4.P$1 47.88,72.77 52.32,72.77 52.96,72.14 v52.96,71.88
  Top 0.61: 31.11,71.97 IC5.7 v31.11,68.58 | 31.11,71.97 C14.P$2 | v31.11,73.15 31.11,71.97 | v26.42,63.88 26.42,64.55 R26.P$2 27.43,64.55 v27.43,63.88 | 31.11,71.97 32.49,71.97 C34.P$2 32.52,73.15 v32.51,73.15
  other vias: 53.98,71.88 52.2,66.17 53.34,66.17 54.61,66.17 51.18,68.07 51.18,66.93 54.61,70.87 54.61,69.6 55.5,68.2 55.5,67.18
  pour Top (no thermals): 50.8,65.41 56.52,65.41 56.52,72.01 50.8,72.01
  pour Bottom (no thermals): 55.24,65.41 56.52,65.41 56.52,74.3 55.88,74.3 23.5,74.3 23.5,63.5 27.94,63.5 27.94,67.94 50.8,67.94 50.8,65.41
-5V  (via drill 0.35, 0.45)
  Top 0.305: P3.P$1 53.21,58.17 v53.34,58.04
  Top 0.61: IC5.4 arc-90 33.7,64.66 C35.P$2 | v33.66,66.04 IC5.4 | v33.66,63.25 IC5.4 | v35.43,63.75 C35.P$2 | C35.P$2 C15.P$2 v36.96,63.75
  other vias: 52.07,52.32 53.21,52.32 54.36,52.32 52.32,57.15 52.32,56.01 54.61,57.15 54.61,56.01 55.37,54.23 55.37,53.21 51.31,54.36 51.31,53.21 53.34,55.12
  pour Top (no thermals): 51.05,51.44 51.05,58.55 56.13,58.55 56.13,51.44
  pour Bottom (no thermals): 33.02,66.67 33.02,62.87 40.01,55.88 50.8,55.88 50.8,51.44 55.88,51.44 55.88,58.42 48.26,58.42 40.01,66.67
CLK-SEL  (via drill 0.4)
  Top 0.34: IC4.27 31.75,26.18 31.75,24.77 v31.68,24.84 | v31.75,19.3 v31.75,17.65 | v15.24,20.95 15.11,20.95 14.22,21.84 14.22,22.75 IC8.16
  Bottom 0.34: v31.68,24.84 31.68,19.37 v31.75,19.3 | v31.75,17.65 21.72,17.65 19.18,20.19 16,20.19 v15.24,20.95
CLOCK-OUT
  Top 0.127: J4.P$3 J4.CENTER@1
  Top 0.349: R27.2 R28.2 R19.2 8.14,20.07 8.13,20.07 8.14,20.06 | 8.14,20.06 R20.2 R25.2 | 8.14,20.06 8.14,20.07 J4.CENTER@1
COMP-CLK  (via drill 0.35, 0.4)
  Top 0.34: IC8.12 16.84,21.27 v17.14,20.95 | v34.29,18.16 36.55,18.16
  Top 0.349: 36.55,18.16 IC4.14
  Bottom 0.34: v17.14,20.95 19.68,20.95 22.23,18.41 34.04,18.41 v34.29,18.16
D0  (via drill 0.35)
  Top 0.254: IC4.38 24.22,21.37 v23.56,22.04 | v26.8,37.85 24.97,37.85 IC3.23
  Bottom 0.254: v23.56,22.04 23.56,28.89 28.07,33.4 28.07,36.58 v26.8,37.85
D1  (via drill 0.35)
  Top 0.254: IC3.25 26.54,34.54 v26.16,34.16 | v21.46,23.24 21.48,23.24 24.14,20.57 IC4.39
  Bottom 0.254: v26.16,34.16 21.46,29.46 v21.46,23.24
D2  (via drill 0.35)
  Top 0.254: IC3.26 27.46,35.35 27.46,34.58 v26.16,33.27 | v22.1,21.59 23.91,19.77 IC4.40
  Bottom 0.254: v26.16,33.27 22.1,29.21 v22.1,21.59
D3  (via drill 0.35)
  Top 0.254: IC3.27 28.14,34.36 v27.05,33.27 | v22.73,20.07 23.82,18.97 IC4.41
  Bottom 0.254: v22.73,20.07 22.73,28.96 v27.05,33.27
D4  (via drill 0.35)
  Top 0.254: IC3.29 29.74,34.18 v28.45,32.89 | IC4.2 27.71,14.92 27.71,20.81 v26.61,21.91
  Bottom 0.254: v28.45,32.89 24.26,28.7 24.26,24.26 v26.61,21.91
D5  (via drill 0.35)
  Top 0.254: IC3.30 30.54,34.09 v29.34,32.89 | v26.54,22.86 28.45,20.95 28.45,14.89 IC4.3
  Bottom 0.254: v29.34,32.89 24.89,28.45 24.89,24.51 v26.54,22.86
D6  (via drill 0.35)
  Top 0.254: IC3.31 31.34,34 v30.23,32.89 | v26.54,23.88 29.21,21.21 29.21,14.93 IC4.4
  Bottom 0.254: v30.23,32.89 25.53,28.19 25.53,24.77 26.42,23.88 v26.54,23.88
D7  (via drill 0.35)
  Top 0.254: IC3.32 32.14,34.04 v31.11,33.02 | v26.54,24.77 30.1,21.21 30.1,14.91 IC4.5
  Bottom 0.254: v31.11,33.02 26.29,28.19 26.29,25.02 v26.54,24.77
D8  (via drill 0.35)
  Top 0.254: IC4.25 33.26,27.04 33.27,27.05 v33.27,27.43 | v33.53,35.31 33.74,35.52 IC3.1
  Bottom 0.254: v33.53,35.31 33.4,35.18 33.4,27.56 v33.27,27.43
D9  (via drill 0.35)
  Top 0.254: IC3.2 33.7,37.85 v32.13,37.85 | IC4.26 32.51,26.22 v32.51,24.89
  Bottom 0.254: v32.51,24.89 32.51,27.95 32.92,28.36 32.92,37.06 v32.13,37.85
GND  (via drill 0.35, 0.4)  (10 unrouted)
  Top 0.61: v10.82,35.41 10.79,35.43 IC1.5
  other vias: 11.81,20.7 11.81,19.43 18.16,21.59 18.16,18.54 18.16,24 18.16,16.13 13.97,20.7 13.97,19.43 5.97,6.35 7.87,6.35 6.99,5.59 6.48,9.91 7.37,10.79 29.72,12.7 30.61,11.68 29.72,29.59 28.83,28.57 30.1,27.56 30.86,13.59 30.86,16.13 30.1,25.02 35.81,35.56 35.05,35.56 35.81,44.2 35.18,44.2 36.83,45.34 49.15,70.99 49.15,70.23 49.15,69.47 50.16,71.75 50.16,68.71 45.85,66.04 44.58,66.04 47.12,66.04 47.12,64.77 45.85,64.77 44.58,64.77 44.58,63.5 45.85,63.5 47.12,63.5 47.12,67.31 45.85,67.31 44.58,67.31 43.31,67.31 43.31,66.04 43.31,64.77 43.31,63.5 48.39,67.31 48.39,66.04 48.39,64.77 48.39,63.5 50.93,37.59 50.93,36.7 50.93,35.81 48.77,37.72 48.77,36.7 48.77,35.69 53.98,26.8 53.98,25.91 53.98,25.02 51.82,26.8 51.82,25.91 51.82,25.02 55.5,29.72 55.5,28.7 52.83,29.59 52.83,28.57 21.74,37.19 21.62,42.9 20.73,38.2 20.73,41.76 28.47,48.49 29.36,48.49 24.28,36.3 25.17,36.3 31.39,42.9 32.92,44.68 32.66,45.57 28.73,34.14 28.98,36.8 50.29,61.34 51.18,60.58 51.18,59.69 50.29,58.8 49.28,60.83 49.28,59.56 49.28,56.52 49.28,55.63 50.04,55.12 55.37,49.66 55.37,48.77 51.18,49.78 51.18,48.64 52.32,50.67 53.34,50.67 54.48,50.67 52.2,47.75 53.34,47.75 54.48,47.75 50.55,46.86 50.55,45.72 52.7,46.86 52.7,45.72 47.62,22.23 47.62,21.34 47.62,20.45 46.61,23.11 45.34,22.35 45.34,21.46 52.32,14.48 52.32,13.46 49.53,14.48 49.53,13.34 50.93,11.56 50.93,10.54 50.93,9.53 48.51,11.56 48.51,10.54 48.51,9.53 34.42,30.61 37.08,30.73 35.18,29.72 36.07,29.72 41.27,31.37 42.04,31.37 20.95,12.57 22.73,12.57 40.89,36.07 41.15,35.43 41.15,34.8 14.1,11.43 1.27,1.27 5.21,1.27 7.75,1.27 10.29,1.27 12.83,1.27 22.99,1.27 25.53,1.27 28.07,1.27 45.85,1.27 48.39,1.27 50.93,1.27 53.47,1.27 56.01,1.27 58.55,1.27 61.09,1.27 63.63,1.27 1.27,13.34 1.27,25.27 1.27,64.77 1.27,67.31 1.27,69.85 1.27,72.39 5.21,72.39 7.75,72.39 10.29,72.39 35.69,72.39 38.23,72.39 43.31,72.39 45.85,73.66 48.39,73.66 50.93,73.66 54.74,73.66 56.01,72.39 58.55,72.39 61.09,72.39 63.63,72.39 63.63,69.85 63.63,67.31 63.63,54.61 63.63,52.07 63.63,49.53 63.63,38.1 63.63,35.56 63.63,33.02 63.63,30.48 63.63,27.94 63.63,15.24 63.63,12.7 63.63,10.16 63.63,7.62 63.63,5.08 9.4,4.45 11.94,4.45 11.94,8.26 14.48,8.26 14.48,4.45 16.03,32.49 16.03,31.72 9.42,32.49 9.42,31.72 18.44,37.06 18.44,36.17 19.2,55.47 19.96,61.95 19.2,61.95 19.96,55.47 10.44,53.95 10.95,52.93 11.71,52.93 9.93,37.19 9.93,36.42 9.93,35.53 10.19,60.55 12.73,60.55 10.82,61.32 11.71,61.32 8.92,52.93 9.55,52.93 16.89,29.72 18.16,31.62 20.7,32.26 20.7,30.35 18.8,29.08 22.61,32.26 31.5,32 30.48,30.35 34.67,32.38 37.21,32.38 34.8,34.67 35.94,34.54 40.39,33.91 40.13,36.07 35.05,67.06 35.81,67.06 36.58,67.06 37.34,67.06 22.1,53.72 22.1,51.18 22.1,48.64 24.64,48.64 22.73,63.25 24.64,63.25 27.43,72.39 24.26,72.39 16.64,52.7 16.64,49.53 16.64,46.35 10.92,49.53 10.92,47.62 7.75,47.62 7.75,42.55 5.84,38.1 7.75,30.48 16.64,43.81 18.54,42.55 19.81,37.47 10.92,52.07 30.76,42.27 28.22,37.82 29.49,37.82 31.39,41.63
  pour Top (rank 2, no thermals): 0,0 65.66,0 65.66,74.42 0,74.42
  pour Route2 (no thermals): 0,0 0,74.42 65.66,74.42 65.66,0
  cutout Top (no thermals): 32.89,42.04 32.89,38.1 44.07,38.1 44.07,42.04
  pour Bottom (rank 2, no thermals): 0,0 65.66,0 65.66,74.42 0,74.42
  cutout Top (no thermals): 26.04,41.27 14.61,41.27 arc90 10.79,37.47 10.79,33.02 14.61,33.02 14.61,37.47 arc-90 15.75,38.61 26.04,38.61
  cutout Top (no thermals): 12.7,41.27 12.7,57.02 arc-90 15.62,59.94 21.21,59.94 21.21,57.53 16.26,57.53 arc90 15.24,56.52 15.24,41.27
  cutout Top (no thermals): 4.7,46.61 10.54,46.61 arc-90 12.95,44.2 12.95,38.86 11.3,38.86 11.3,43.31 arc90 10.41,44.2 4.7,44.2
  cutout Top (no thermals): 11.43,43.18 9.53,43.18 arc90 6.35,40.01 6.35,35.31 arc-90 4.57,33.53 4.57,31.75 5.71,31.75 arc90 8.89,34.92 8.89,39.37 arc-90 10.16,40.64 11.43,40.64
ICSPCLK
  Top 0.254: IC4.16 37.88,19.77 38.35,19.3 38.35,8.13 33.53,3.3 J2.5
ICSPDAT
  Top 0.254: IC4.17 38.23,20.57 39.12,19.68 39.12,7.87 36.07,4.83 J2.4
LE_N
  Top 0.34: IC3.21 14.71,39.48 arc90 13.34,38.1 IC1.7 13.34,33.82 arc90 R1.P$2
  Top 0.61: R3.P$1 R1.P$2 arc90 13.34,33.82
LE_P1
  Top 0.34: IC3.20 14.24,40.28 arc90 12.06,38.1 IC1.6 12.06,33.82 arc-90 R2.P$2
  Top 0.61: R4.P$1 R2.P$2
N$1
  Top 0.349: U$36.4 11.03,6.42 arc90 R31.P$1
N$2
  Top 0.34: IC1.1 14.61,56.9 arc-90 15.75,58.04 IC2.2 19.52,58.04 arc-90 R7.P$1
  Top 0.61: R5.P$2 R7.P$1
N$3
  Top 0.34: IC1.2 13.34,56.77 arc-90 15.88,59.31 IC2.3 19.52,59.31 arc90 R12.P$1
  Top 0.61: R6.P$2 R12.P$1
N$5
  Top 0.34: R13.P$1 IC2.7
N$6
  Top 0.254: IC3.16 R11.2
N$7
  Top 0.254: IC3.12 29.74,46.38 R10.2
N$8
  Top 0.254: IC3.11 30.54,45.78 R9.2
N$9
  Top 0.254: IC3.10 31.34,45.19 R8.2
N$15  (1 unrouted)
  Top 0.34: R13.P$2 2.92,58.04 arc-90 2.54,58.42 2.29,58.42 arc90 J8.CENTER@1
N$16
  Top 0.349: 34.42,39.48 42.15,39.48 arc90 43.43,40.77 IC6.2 | 34.42,39.48 IC3.4 | 34.42,39.48 35.56,38.34 R23.P$1 R21.P$2
N$17  (via drill 0.45)
  Top 0.305: v39.5,24.51 39.43,24.57 IC4.22
  Top 0.61: IC5.6 32.38,67.94 31.11,66.67 IC5.2 v31.11,62.87
  Bottom 0.61: v39.5,24.51 39.5,35.7 39.42,35.77 39.42,54.56 v31.11,62.87
N$18
  Top 0.349: IC8.11 17.48,25.73 R18.P$1
N$19  (via drill 0.45)
  Top 0.61: R15.P$2 24.86,66.55 R14.P$1 R26.P$1 28.28,66.51 v28.32,66.55 | v32.38,66.29 IC5.3
  Bottom 0.61: v28.32,66.55 32.13,66.55 v32.38,66.29
N$21
  Top 0.61: R15.P$1 J11.CENTER J1.1
  pour Top (no thermals): 2.92,69.47 4.45,69.47 5.33,68.58 4.45,67.69 2.92,67.69
N$22
  Top 0.349: 34.54,40.28 37.97,40.28 arc90 38.31,40.61 arc-90 38.64,40.95 38.68,40.95 arc-90 39.01,40.61 arc90 39.35,40.28 39.39,40.28 arc90 39.72,40.61 arc-90 40.05,40.95 40.09,40.95 arc-90 40.43,40.61 arc90 40.76,40.28 40.91,40.28 arc90 42.16,41.53 IC6.3 | 34.54,40.28 IC3.5 | 34.54,40.28 35.56,41.29 R24.P$1 R22.P$2
N$23
  Top 0.34: R31.P$2 12.54,7.62 arc-90 15.08,10.16 16.51,10.16 arc90 18.79,12.44 IC8.8
N$24
  Top 0.305: X1.3 35.72,25.43 34.42,24.13 29.97,24.13 29.26,24.84 IC4.30
N$25
  Top 0.305: IC4.42 22.78,18.17 R33.P$1
N$26
  Top 0.305: R33.P$2 U$88.A
N$35
  Top 0.254: IC3.3 32.57,38.68 32.13,39.12 32.13,42.8 34.8,45.47 34.8,46.1 35.52,46.83 R16.P$2
N$36
  Top 0.34: R18.P$2 17.53,28.57 arc-90 20.07,31.11 32.38,31.11 arc90 33.66,32.38 arc-90 34.92,33.66 38.1,33.66 arc90 39.37,34.92 39.37,38.1 arc-90 40.01,38.73 43.18,38.73 arc-90 43.43,38.48 IC6.7
N$38
  Top 0.349: R28.1 12.31,24.89 14.73,24.89 15.54,24.09 IC8.14
N$39
  Top 0.349: R27.1 11.93,25.65 15.03,25.65 16.18,24.49 IC8.13
N$41
  Top 0.349: IC8.5 16.84,15.44 16.13,14.73 11.56,14.73 9.91,16.38 9.91,18.03 9.65,18.29 R25.1
N$42
  Top 0.349: IC8.4 16.18,15.93 15.62,15.37 11.81,15.37 10.54,16.64 10.54,18.41 9.53,19.43 R20.1
N$43
  Top 0.349: IC8.3 15.54,16.3 15.24,16 12.03,16 11.14,16.89 11.14,18.57 R19.1
N$44
  Top 0.349: IC4.44 25.16,13.95 19.05,7.84 R29.P$1
N$45
  Top 0.349: IC4.1 26.86,13.62 R30.P$1
RX
  Top 0.349: U$54.3 R30.P$2
SAMPLE-CLOCK  (via drill 0.35, 0.4)
  Top 0.34: IC8.9 19.56,22.77 v19.56,22.73 | v27.69,24.89 27.69,26.25 IC4.32
  Bottom 0.34: v19.56,22.73 19.56,22.35 22.86,19.05 24.77,19.05 27.69,21.97 v27.69,24.89
STROBE  (2 unrouted)
  Top 0.34: IC1.3 12.06,44.2 arc90 10.92,45.34 10.25,45.34 arc-90 9.92,45.67 9.92,45.75 arc90 9.59,46.08 8.96,46.08 arc90 8.63,45.75 8.63,44.93 arc-90 8.3,44.6 7.67,44.6 arc-90 7.34,44.93 7.34,45.75 arc90 7.01,46.08 6.37,46.08 arc90 6.04,45.75 6.04,45.67 arc-90 5.71,45.34 J10.P$3 | 3.94,45.09 1.27,45.09
TRIGGER  (1 unrouted)
  Top 0.349: J3.P$3 U$36.2
TX
  Top 0.349: U$54.1 16.13,6.01 R29.P$2
VCC2  (via drill 0.35)
  Top 0.254: R17.P$1 41.15,4.03 J2.2
  Top 0.508: IC4.7 31.66,13.16 C23.P$2 | IC4.28 30.86,28.21 C22.P$2 31.37,28.71 | v31.37,29.59 31.37,28.71 | v32.13,28.57 31.51,28.57 31.37,28.71
  Top 1.016: IC11.2 IC11.4
  other vias: 9.78,9.91 8.89,10.79 8.26,8.38 33.02,12.7 43.18,17.78 44.45,17.78 45.72,17.78 43.18,16.51 44.45,16.51 45.72,16.51 45.72,15.24 44.45,15.24 43.18,15.24 43.18,13.97 44.45,13.97 45.72,13.97 45.72,19.05 44.45,19.05 43.18,19.05 46.99,19.05 46.99,17.78 46.99,16.51 46.99,15.24 46.99,13.97 43.18,12.7 44.45,12.7 44.45,11.43 43.18,11.43 46.61,12.32 46.61,9.02 45.34,10.67 38.23,28.45 38.23,27.43 42.04,27.81 38.23,29.34 32.13,11.68 41.27,27.81
  pour Top (no thermals): 8,11.05 8,7.75 10.03,7.75 10.03,11.05
  pour Route15 (no thermals): 0,0 52.83,0 52.83,22.73 47.62,22.73 39.24,31.11 27.05,31.11 21.08,25.15 21.08,15.49 18.16,12.57 0,12.57
  pour Top (no thermals): 47.62,8.13 47.62,19.81 42.42,19.81 42.42,8.13
  pour Top (no thermals): 37.85,29.84 42.42,29.84 42.42,27.81 41.66,27.05 37.85,27.05
  pour Top (no thermals): 31.5,11.3 33.78,11.3 33.78,13.34 31.5,13.34
VIN3.3
  Top 1.27: IC10.3 52.98,34.91 C7.P$2 54.86,36.7 60.58,30.99 J7.P$1 56.01,24.13 53.34,21.46 C9.P$2 49.68,19.68 IC11.3
VIN+5
  Top 1.27: J6.P$1 53.47,62.87 IC13.1 53.37,62.97 C13.P$2
VIN-5  (via drill 0.35)
  Top 1.27: J5.P$1 55.75,46.35 53.21,43.81 49.66,43.81 48.49,44.98 C11.P$2 46.16,48.56 IC12.4
  other vias: 47.62,53.47 46.35,53.47 45.09,53.47 43.81,53.47 43.81,52.2 45.09,52.2 46.35,52.2 47.62,52.2 47.62,50.93 46.35,50.93 45.09,50.93 43.81,50.93 43.81,49.66 45.09,49.66 46.35,49.66 47.62,49.66 48.9,53.47 48.9,52.2 48.9,50.93 48.9,49.66
  pour Top (no thermals): 42.67,55.24 42.67,46.99 49.66,46.99 49.66,55.24

### Text on the board
tPlace: GND | +5 | +5 | SAMPLE | +7.5 | GND | -5 | -5 | -7.5 | STROBE-LVCMOS | STROBE | GND | !STROBE! | +4.5 | ECL | +3.3 | CLOCK OUT | GND | CMOS | +3.3 | Analog Sampler | Testbed | G | TX | RX | ICSP | TRIGGER | Yapo 9/2019 | 1
bPlace: +7.5 | GND | -7.5 | GND | +4.5 | GND